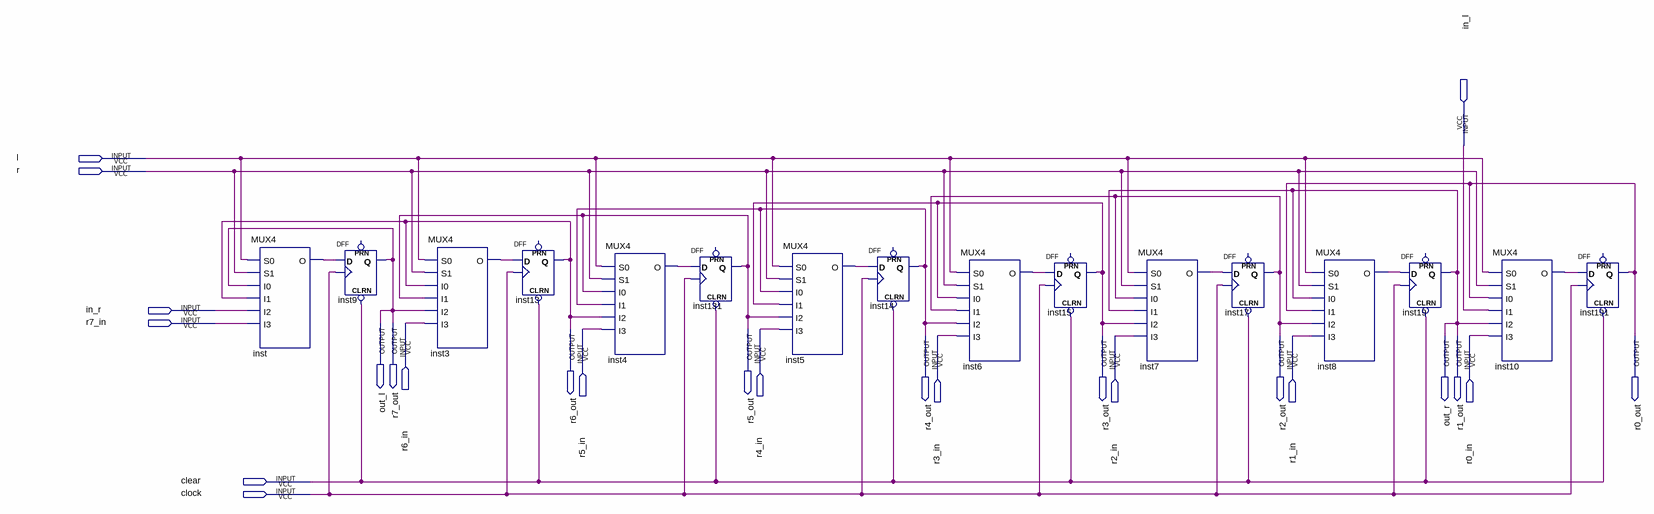
[diagram p0: schematic sheet]
// Quartus schematic shift_register8.bdf as structural Verilog: 16 symbols, 24 pins
module shift_register8 (
  input  in_l,
  input  l,
  input  r,
  input  in_r,
  input  r7_in,
  input  r6_in,
  input  r5_in,
  input  r4_in,
  input  r3_in,
  input  r2_in,
  input  r1_in,
  input  r0_in,
  input  clear,
  input  clock,
  output out_l,
  output r7_out,
  output r6_out,
  output r5_out,
  output r4_out,
  output r3_out,
  output r2_out,
  output out_r,
  output r1_out,
  output r0_out
);

  wire inst3_o, inst4_o, inst5_o, inst6_o, inst7_o, inst8_o, inst10_o, inst_o;

  MUX4 inst (.I1(l), .I0(r), .I3(out_l), .I2(r6_out), .S1(in_r), .S0(r7_in), .O(inst_o));
  DFF inst9 (.CLRN(clear), .CLK(clock), .D(inst_o), .Q(out_l));  // open: PRN
  MUX4 inst3 (.I1(l), .I0(r), .I3(r6_out), .I2(r5_out), .S1(out_l), .S0(r6_in), .O(inst3_o));
  DFF inst13 (.CLRN(clear), .CLK(clock), .D(inst3_o), .Q(r6_out));  // open: PRN
  MUX4 inst4 (.I1(l), .I0(r), .I3(r5_out), .I2(r4_out), .S1(r6_out), .S0(r5_in), .O(inst4_o));
  DFF inst131 (.CLRN(clear), .CLK(clock), .D(inst4_o), .Q(r5_out));  // open: PRN
  MUX4 inst5 (.I1(l), .I0(r), .I3(r4_out), .I2(r3_out), .S1(r5_out), .S0(r4_in), .O(inst5_o));
  DFF inst14 (.CLRN(clear), .CLK(clock), .D(inst5_o), .Q(r4_out));  // open: PRN
  MUX4 inst6 (.I1(l), .I0(r), .I3(r3_out), .I2(r2_out), .S1(r4_out), .S0(r3_in), .O(inst6_o));
  DFF inst15 (.CLRN(clear), .CLK(clock), .D(inst6_o), .Q(r3_out));  // open: PRN
  MUX4 inst7 (.I1(l), .I0(r), .I3(r2_out), .I2(out_r), .S1(r3_out), .S0(r2_in), .O(inst7_o));
  DFF inst17 (.CLRN(clear), .CLK(clock), .D(inst7_o), .Q(r2_out));  // open: PRN
  MUX4 inst8 (.I1(l), .I0(r), .I3(out_r), .I2(r0_out), .S1(r2_out), .S0(r1_in), .O(inst8_o));
  DFF inst19 (.CLRN(clear), .CLK(clock), .D(inst8_o), .Q(out_r));  // open: PRN
  MUX4 inst10 (.I1(l), .I0(r), .I3(r0_out), .I2(in_l), .S1(out_r), .S0(r0_in), .O(inst10_o));
  DFF inst191 (.CLRN(clear), .CLK(clock), .D(inst10_o), .Q(r0_out));  // open: PRN

  assign r1_out = out_r;
  assign r7_out = out_l;
endmodule
